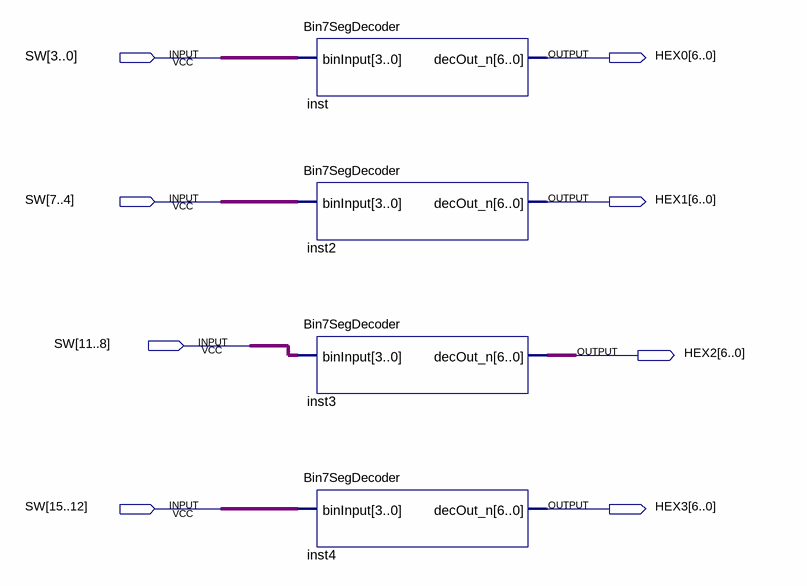
[diagram p0: schematic sheet]
// Quartus schematic Block2.bdf as structural Verilog: 4 symbols, 8 pins
module Block2 (
  input  [15:0] SW,
  output [6:0] HEX0,
  output [6:0] HEX1,
  output [6:0] HEX2,
  output [6:0] HEX3
);

  Bin7SegDecoder inst (.binInput(SW[3:0]), .decOut_n(HEX0));
  Bin7SegDecoder inst2 (.binInput(SW[7:4]), .decOut_n(HEX1));
  Bin7SegDecoder inst3 (.binInput(SW[11:8]), .decOut_n(HEX2));
  Bin7SegDecoder inst4 (.binInput(SW[15:12]), .decOut_n(HEX3));
endmodule
